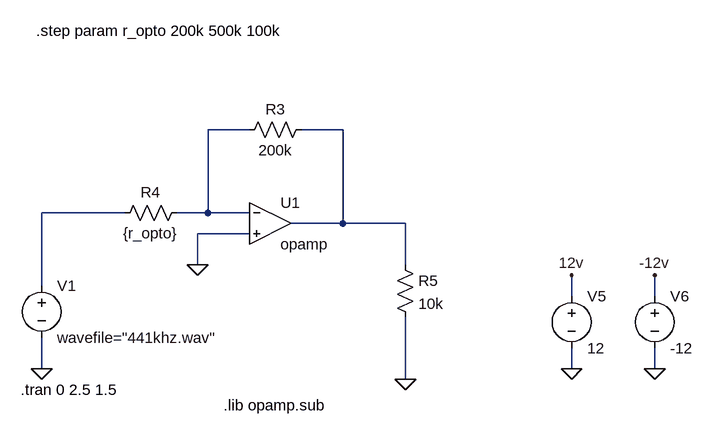
[diagram p0: schematic Opto LED bias.asc]
Opto LED bias.asc, the LTspice schematic file:
Version 4
SHEET 1 4852 1284
WIRE 1040 144 976 144
WIRE 1184 144 1120 144
WIRE 848 272 720 272
WIRE 976 272 976 144
WIRE 976 272 928 272
WIRE 1040 272 976 272
WIRE 1184 288 1184 144
WIRE 1184 288 1104 288
WIRE 1280 288 1184 288
WIRE 1040 304 960 304
WIRE 960 352 960 304
WIRE 1280 352 1280 288
WIRE 720 384 720 272
WIRE 1536 400 1536 368
WIRE 1664 400 1664 368
WIRE 720 512 720 464
WIRE 1536 512 1536 480
WIRE 1664 512 1664 480
WIRE 1280 528 1280 432
FLAG 720 512 0
FLAG 960 352 0
FLAG 1536 512 0
FLAG 1664 512 0
FLAG 1664 368 -12v
FLAG 1536 368 12v
FLAG 1280 528 0
SYMBOL voltage 720 368 R0
SYMATTR InstName V1
SYMATTR Value wavefile="441khz.wav"
SYMBOL Opamps\\opamp 1072 224 R0
SYMATTR InstName U1
SYMBOL res 944 256 R90
WINDOW 0 0 56 VBottom 2
WINDOW 3 32 56 VTop 2
SYMATTR InstName R4
SYMATTR Value {r_opto}
SYMBOL res 1136 128 R90
WINDOW 0 0 56 VBottom 2
WINDOW 3 32 56 VTop 2
SYMATTR InstName R3
SYMATTR Value 200k
SYMBOL voltage 1664 384 R0
WINDOW 123 0 0 Left 2
WINDOW 39 0 0 Left 2
SYMATTR InstName V6
SYMATTR Value -12
SYMBOL voltage 1536 384 R0
WINDOW 123 0 0 Left 2
WINDOW 39 0 0 Left 2
SYMATTR InstName V5
SYMATTR Value 12
SYMBOL res 1264 336 R0
SYMATTR InstName R5
SYMATTR Value 10k
TEXT 688 544 Left 2 !.tran 0 2.5 1.5
TEXT 1000 568 Left 2 !.lib opamp.sub
TEXT 712 -8 Left 2 !.step param r_opto 200k 500k 100k

The netlist it stands for:
* Opto LED bias.asc
V1 N003 0 wavefile="441khz.wav"
XU1 N001 0 N002 opamp Aol=100K GBW=10Meg  ; pins invin noninvin out
R4 N001 N003 {r_opto}
R3 N002 N001 200k
V6 -12v 0 -12
V5 12v 0 12
R5 N002 0 10k
.tran 0 2.5 1.5
.lib opamp.sub
.step param r_opto 200k 500k 100k
.backanno
.end